# Altium schematic sheet Detektor Zic,Detektor Vlaznosti.SchDoc
size A4; ApprovedBy: Nejc Klanjšček; CheckedBy: Nejc Klanjšček, Samo Penič; Author: Nejc Klanjšček; DrawnBy: Nejc Klanjšček; Engineer: Nejc Klanjšček; Address1: https://github.com/nejcKlanjscek/SummerCampOfInnovativeTechnologies.git; Address2: nejc.kla@gmail.com; Revision: 1.0; SheetNumber: 2; SheetTotal: 2; License: MIT License; Project: Poletni tabor inovativnih tehnologij 2021
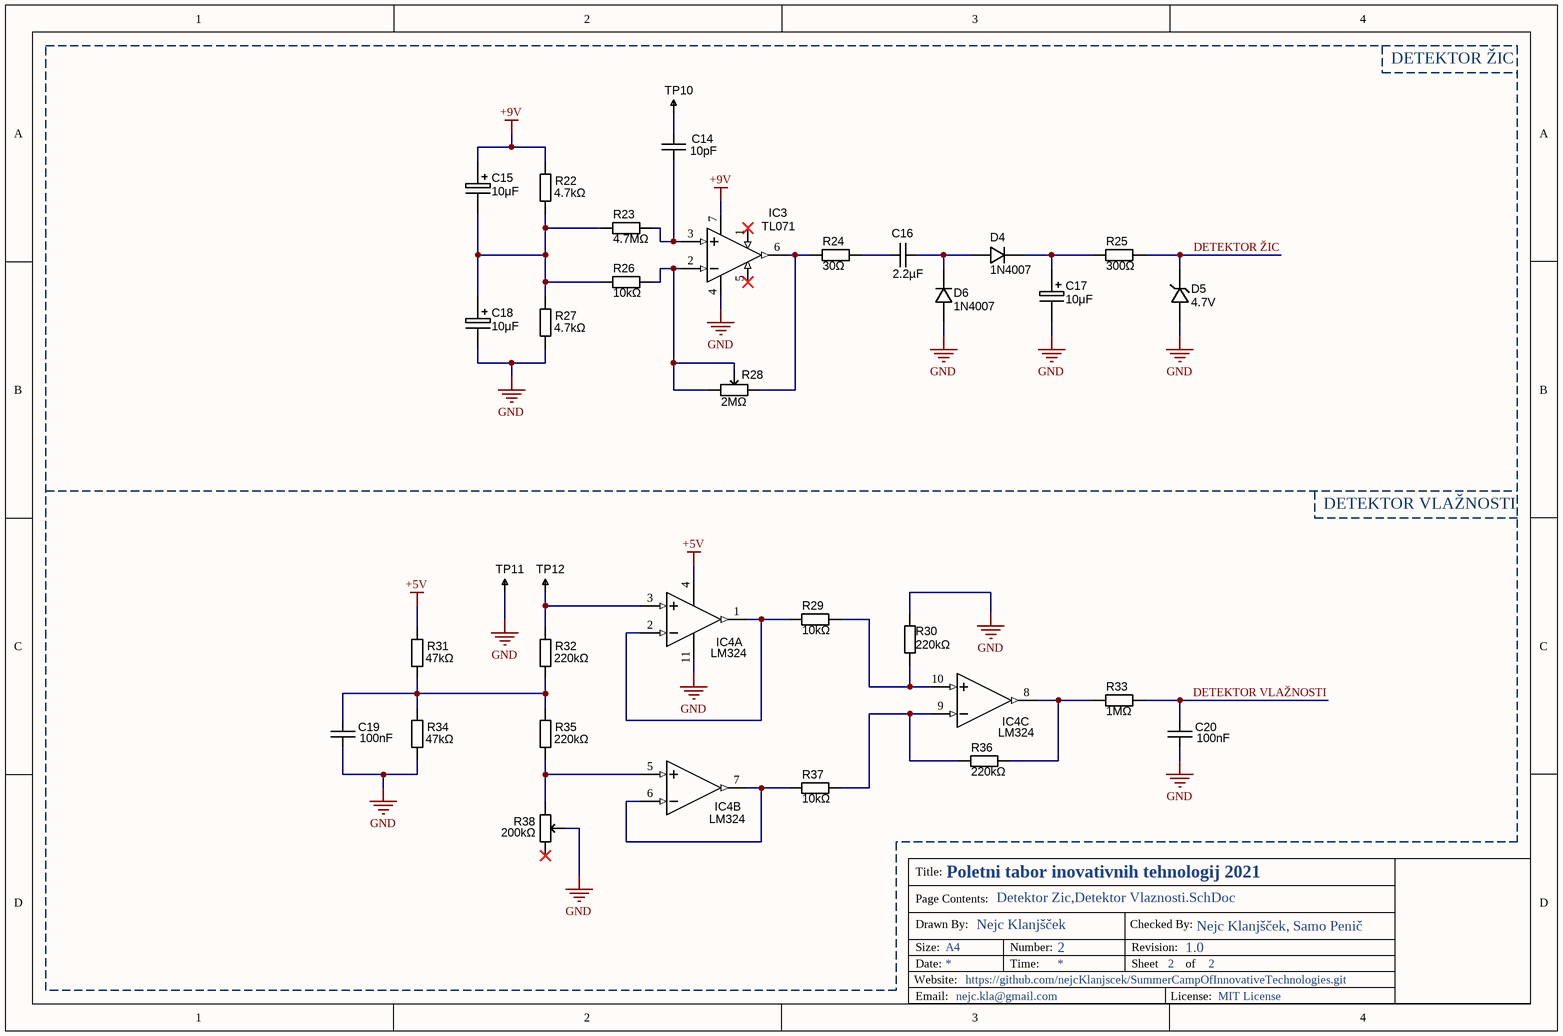
[diagram p0: Detektor Zic,Detektor Vlaznosti.SchDoc]

## Parts
C14  10pF  [CAPC500P450250X550]
C15  10μF  [CAPE_5x11x2LS]
C16  2.2µF  [CAPC500P450250X550]
C17  10μF  [CAPE_5x11x2LS]
C18  10μF  [CAPE_5x11x2LS]
C19  100nF  [CAPC500P450250X550]
C20  100nF  [CAPC500P450250X550]
D4  1N4007  [DO-41]
D5  4.7V  [do-35 - red]
D6  1N4007  [DO-41]
IC3  TL071  [DIP8-300]
IC4  LM324  [DIP794W66P254L1954H508Q14N]  (parts A,B,C of 4)
R22  value 4.7kΩ  [RESTH_AXIAL-1/8W]  (hidden comment: RES_NL_1/8W)  (no BOM)
R23  value 4.7MΩ  [RESTH_AXIAL-1/8W]  (hidden comment: RES_NL_1/8W)  (no BOM)
R24  value 30Ω  [RESTH_AXIAL-1/8W]  (hidden comment: RES_NL_1/8W)  (no BOM)
R25  value 300Ω  [RESTH_AXIAL-1/8W]  (hidden comment: RES_NL_1/8W)  (no BOM)
R26  value 10kΩ  [RESTH_AXIAL-1/8W]  (hidden comment: RES_NL_1/8W)  (no BOM)
R27  value 4.7kΩ  [RESTH_AXIAL-1/8W]  (hidden comment: RES_NL_1/8W)  (no BOM)
R28  value 2MΩ  [3386F1153]  (hidden comment: Single-turn pot)
R29  value 10kΩ  [RESTH_AXIAL-1/8W]  (hidden comment: RES_NL_1/8W)  (no BOM)
R30  value 220kΩ  [RESTH_AXIAL-1/8W]  (hidden comment: RES_NL_1/8W)  (no BOM)
R31  value 47kΩ  [RESTH_AXIAL-1/8W]  (hidden comment: RES_NL_1/8W)  (no BOM)
R32  value 220kΩ  [RESTH_AXIAL-1/8W]  (hidden comment: RES_NL_1/8W)  (no BOM)
R33  value 1MΩ  [RESTH_AXIAL-1/8W]  (hidden comment: RES_NL_1/8W)  (no BOM)
R34  value 47kΩ  [RESTH_AXIAL-1/8W]  (hidden comment: RES_NL_1/8W)  (no BOM)
R35  value 220kΩ  [RESTH_AXIAL-1/8W]  (hidden comment: RES_NL_1/8W)  (no BOM)
R36  value 220kΩ  [RESTH_AXIAL-1/8W]  (hidden comment: RES_NL_1/8W)  (no BOM)
R37  value 10kΩ  [RESTH_AXIAL-1/8W]  (hidden comment: RES_NL_1/8W)  (no BOM)
R38  value 200kΩ  [3386P1103TLF]  (hidden comment: Single-turn pot)
TP10  TESTPOINT_THT  [TP-THT-MULTI]  (value not drawn)
TP11  TESTPOINT_THT  [TP-THT-MULTI]  (value not drawn)
TP12  TESTPOINT_THT  [TP-THT-MULTI]  (value not drawn)

## Nets
+5V: IC4.4(V+) R31.1
+9V: C15.1 IC3.7(+Vs) R22.1
GND: C17.2 C18.2 C19.2 C20.2 D5.A D6.A IC3.4(-Vs) IC4.11(V-) R27.2 R30.1 R34.2 R38.2(W) TP11.1
DETEKTOR VLAŽNOSTI: C20.1 R33.2
DETEKTOR ŽIC: D5.K R25.2
NetC14_1: C14.1 IC3.3(+IN) R23.2
NetC14_2: C14.2 TP10.1
NetC15_2: C15.2 C18.1 R22.2 R23.1 R26.1 R27.1
NetC16_1: C16.1 R24.2
NetC16_2: C16.2 D4.A D6.K
NetC17_1: C17.1 D4.K R25.1
NetC19_1: C19.1 R31.2 R32.2 R34.1 R35.1
NetIC3_2: IC3.2(-IN) R26.2 R28.2(W) R28.3(CW)
NetIC3_6: IC3.6(OUT) R24.1 R28.1(CCW)
NetIC4_1: IC4.1(OUT) IC4.2(IN-) R29.2
NetIC4_3: IC4.3(IN+) R32.1 TP12.1
NetIC4_5: IC4.5(IN+) R35.2 R38.3(CW)
NetIC4_6: IC4.6(IN-) IC4.7(OUT) R37.2
NetIC4_8: IC4.8(OUT) R33.1 R36.1
NetIC4_9: IC4.9(IN-) R36.2 R37.1
NetIC4_10: IC4.10(IN+) R29.1 R30.2

Not connected (* = marked no-connect by the designer): IC3 1(Vlogic)* 5(~{Latch})*; R38 1(CCW)*

## Notes on the sheet
- DETEKTOR ŽIC
- DETEKTOR VLAŽNOSTI
- Title:
- Page Contents:
- Website:
- Size:
- Date:
- Drawn By:
- Email:
- A4
- Number:
- Time:
- Checked By:
- Revision:
- Sheet
- License:
- of

## Library data of the parts
C14 C16 C19 C20 = CAPC_2u2_FG28_25V
C15 C17 C18 = CAPT_10u_5mm_63V
D4 D6 = DIODE_1N4007_1000V_1.0A_DO-41: Diode 1N4007 1A 1000V THD; Manufacturer 1: Diodes Inc; Manufacturer Part Number 1: 1N4007-T; Ratings: 100V; 1.5A; Diode Type: Standard; Value: Vf = 1.15V @ 1.5A (Max); Package / Case: DO-41; Mounting Type: Through Hole
D5 = BZX79C4V7: Diode Zener SMD 4.7V 0.5W SOD-123; Manufacturer 1: Fairchild Semiconductor; Manufacturer Part Number 1: MMSZ4688; Ratings: 4.7V; 0.5W; Vf=900mV @ 10mA; Material: Si; Tolerance: ±5%; Package / Case: SOD-123; Diode Type: Zener; Supplier 1: Digi-Key; Supplier Part Number 1: MMSZ4688-ND
IC3 = IC_OP-Amp_TL071
IC4 = IC_OP-Amp_LM324
R22 R26 R27 = RES_NL_1/8W: Resistor THD Axial 4.7kΩ 0.125W 1% Carbon Film; Manufacturer 1: Royal Ohm; Ratings: 1/10 W; Tolerance: ±5%; Package / Case: 2010 (5025 metric)
R23 = RES_NL_1/8W: Resistor THD Axial 4.7MΩ 0.125W 1% Carbon Film; Manufacturer 1: Royal Ohm; Ratings: 1/10 W; Tolerance: ±5%; Package / Case: 2010 (5025 metric)
R24 R25 = RES_NL_1/8W: Resistor THD Axial 30Ω 0.125W 1% Carbon Film; Manufacturer 1: Royal Ohm; Ratings: 1/10 W; Tolerance: ±5%; Package / Case: 2010 (5025 metric)
R28 = RES_TRIMMER_2MEG: Trimmer THD 2MΩ 200mW Single-turn; Manufacturer 1: Bourns Inc.; Manufacturer Part Number 1: 3306F-1-103; Tolerance: ±25%; Ratings: 1/5W; Supplier 1: Digi-Key; Supplier Part Number 1: 3306F-103-ND; Material: Cermet; Package / Case: 8.10mm L x 6.81mm W x 7.62mm H
R29 R37 = RES_NL_1/8W: Resistor THD Axial 10kΩ 0.125W 1% Carbon Film; Manufacturer 1: Royal Ohm; Ratings: 1/10 W; Tolerance: ±5%; Package / Case: 2010 (5025 metric)
R30 R32 R35 R36 = RES_NL_1/8W: Resistor THD Axial 220kΩ 0.125W 1% Carbon Film; Manufacturer 1: Royal Ohm; Ratings: 1/10 W; Tolerance: ±5%; Package / Case: 2010 (5025 metric)
R31 R34 = RES_NL_1/8W: Resistor THD Axial 47kΩ 0.125W 1% Carbon Film; Manufacturer 1: Royal Ohm; Ratings: 1/10 W; Tolerance: ±5%; Package / Case: 2010 (5025 metric)
R33 = RES_NL_1/8W: Resistor THD Axial 1MΩ 0.125W 1% Carbon Film; Manufacturer 1: Royal Ohm; Ratings: 1/10 W; Tolerance: ±5%; Package / Case: 2010 (5025 metric)
R38 = RES_TRIMMER_200k: Trimmer THD 10K 200mW Single-turn; Manufacturer 1: Bourns Inc.; Manufacturer Part Number 1: 3306F-1-103; Tolerance: ±25%; Ratings: 1/5W; Supplier 1: Digi-Key; Supplier Part Number 1: 3306F-103-ND; Material: Cermet; Package / Case: 8.10mm L x 6.81mm W x 7.62mm H
TP10-TP12 = TESTPOINT_THT: Test Point PCB mount Multi-purpose Yellow; Manufacturer 1: Keystone Electronics; Manufacturer Part Number 1: 5014; Description 1: TEST POINT PC MULTI PURPOSE YEL; Supplier 1: Digi-Key; Supplier Part Number 1: 5014K-ND; Mounting Type: 0.063" (1.600mm) Hole Diameter; Material: Base, Nylon 46, UL 94V-0